# Altium schematic sheet cnc.SchDoc
size A2
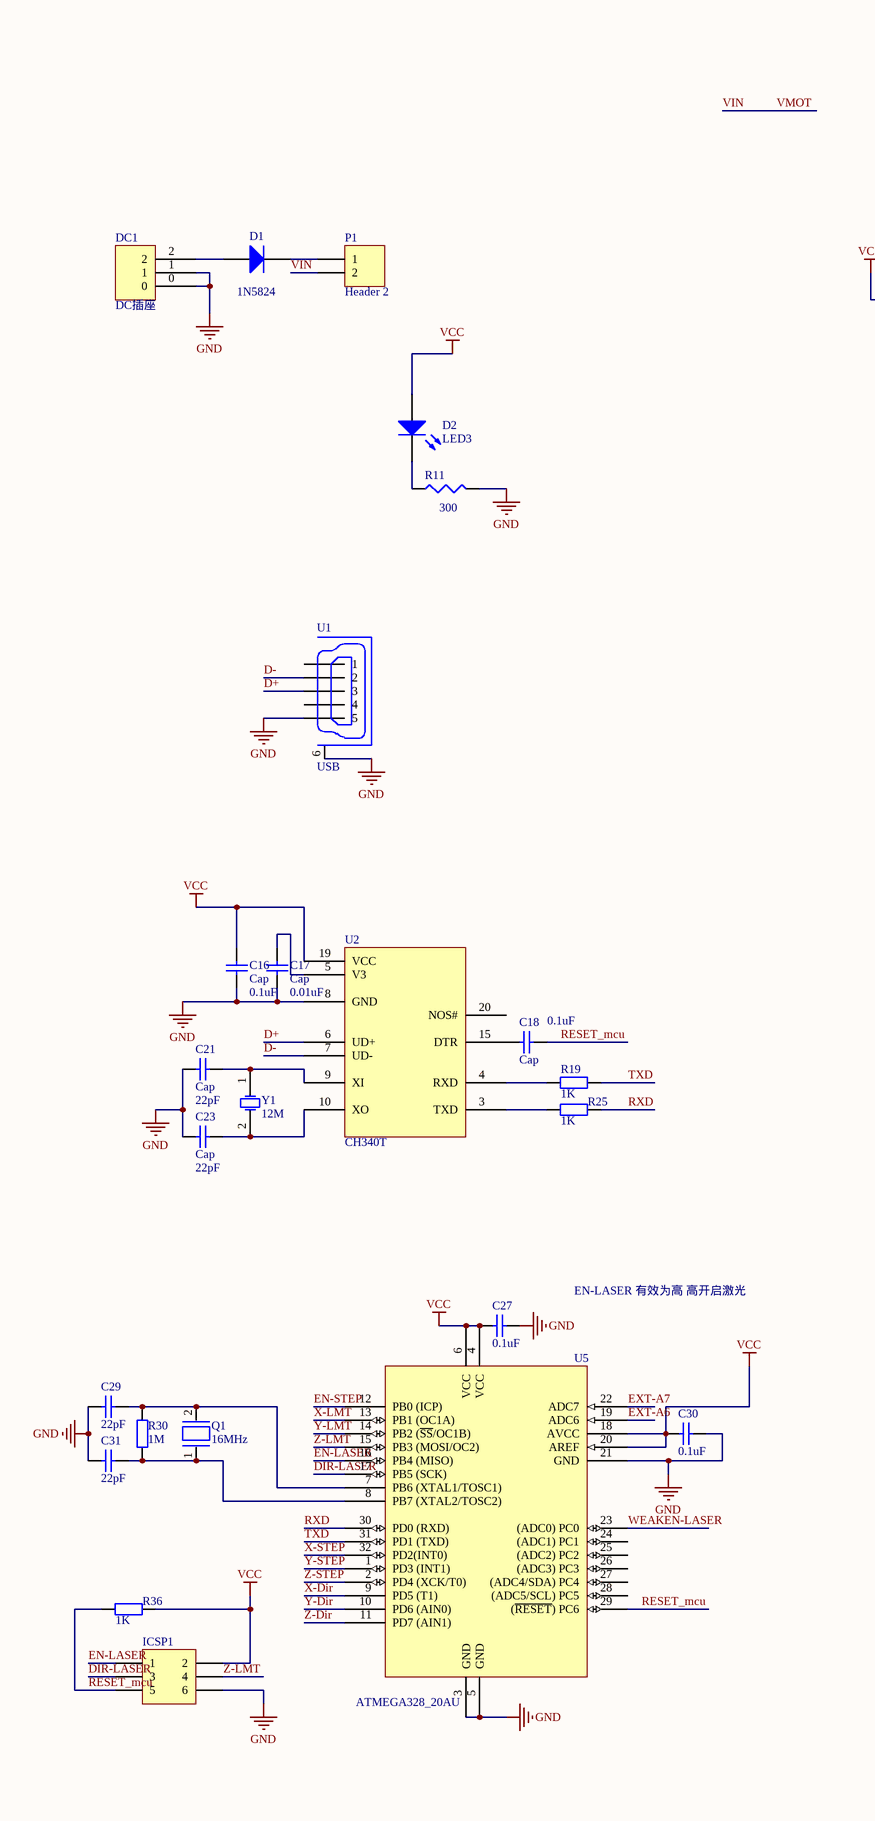
[diagram p0: cnc.SchDoc, left]
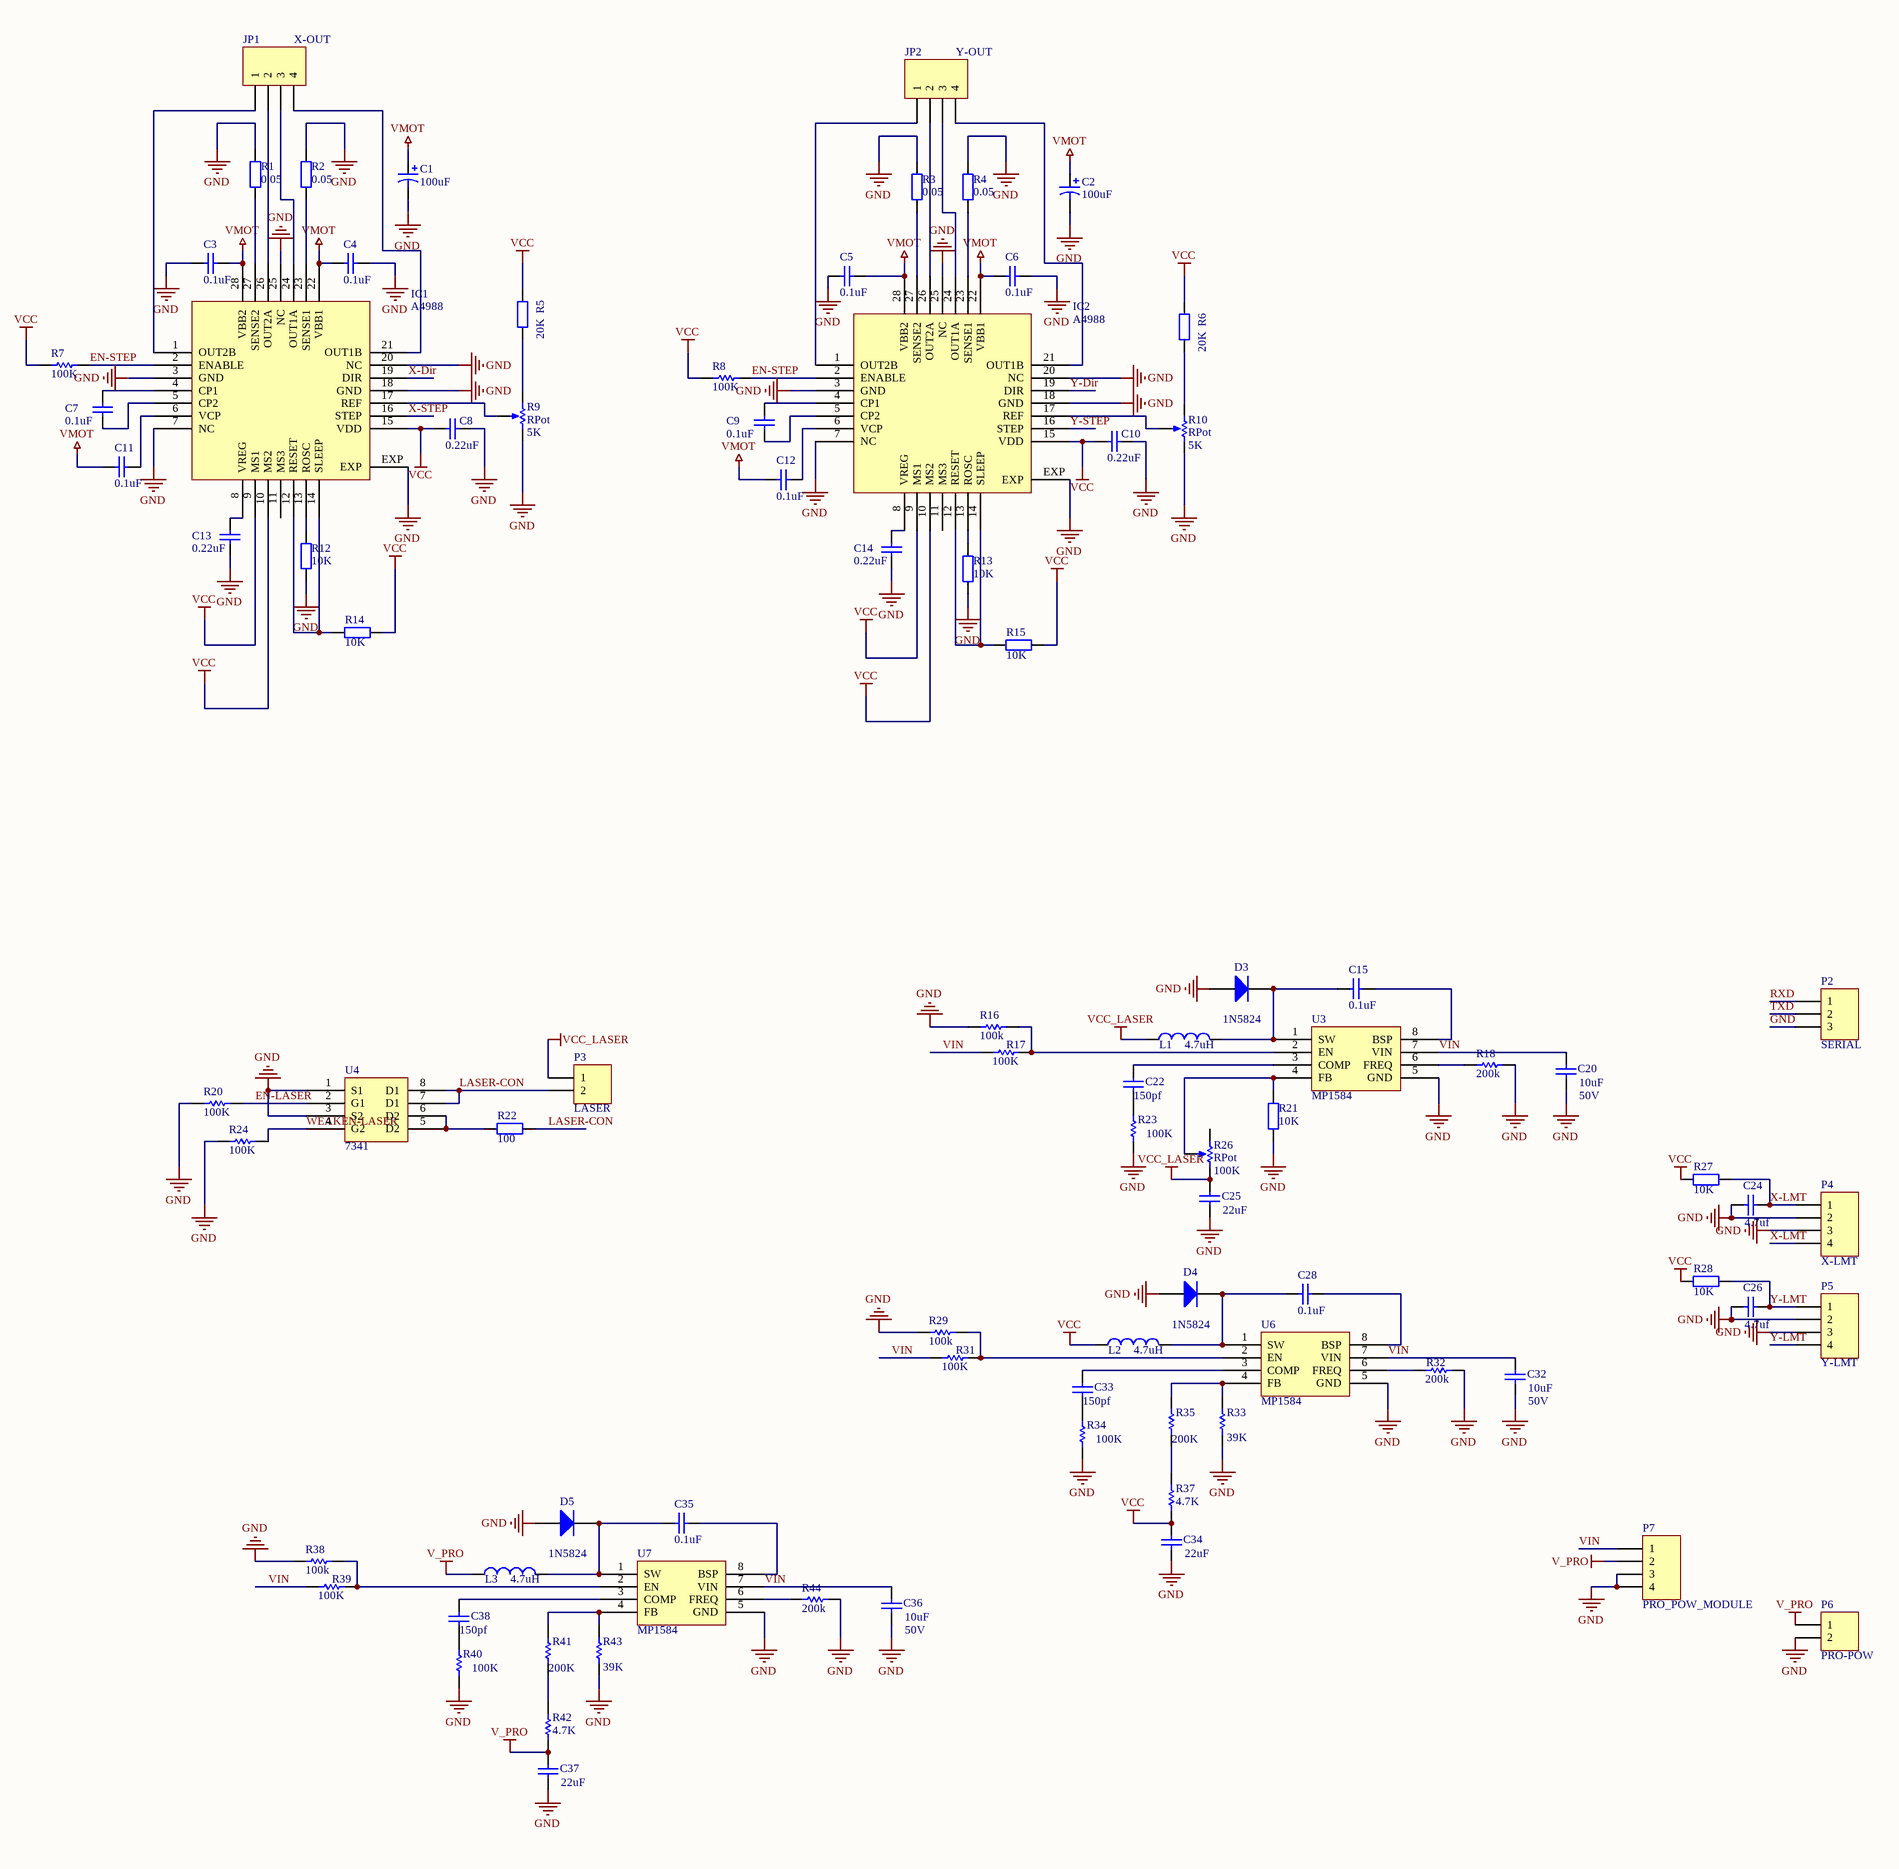
[diagram p1: cnc.SchDoc, right]

## Parts
C1  value 100uF  [CD6032]  (hidden comment: Cap Pol1)
C2  value 100uF  [CD6032]  (hidden comment: Cap Pol1)
C3  value 0.1uF  [C0603]  (hidden comment: Cap)
C4  value 0.1uF  [C0603]  (hidden comment: Cap)
C5  value 0.1uF  [C0603]  (hidden comment: Cap)
C6  value 0.1uF  [C0603]  (hidden comment: Cap)
C7  value 0.1uF  [C0603]  (hidden comment: Cap)
C8  value 0.22uF  [C0603]  (hidden comment: Cap)
C9  value 0.1uF  [C0603]  (hidden comment: Cap)
C10  value 0.22uF  [C0603]  (hidden comment: Cap)
C11  value 0.1uF  [C0603]  (hidden comment: Cap)
C12  value 0.1uF  [C0603]  (hidden comment: Cap)
C13  value 0.22uF  [C0603]  (hidden comment: Cap)
C14  value 0.22uF  [C0603]  (hidden comment: Cap)
C15  value 0.1uF  [C0603]  (hidden comment: Cap)
C16  Cap  value 0.1uF  [C0603]
C17  Cap  value 0.01uF  [C0603]
C18  Cap  value 0.1uF  [C0603]
C20  50V  value 10uF  [C0603]
C21  Cap  value 22pF  [C0603]
C22  value 150pf  [C0603]  (hidden comment: Cap)
C23  Cap  value 22pF  [C0603]
C24  value 4.7uf  [C0603]  (hidden comment: Cap)
C25  value 22uF  [C0603]  (hidden comment: Cap)
C26  value 4.7uf  [C0603]  (hidden comment: Cap)
C27  value 0.1uF  [C0603]  (hidden comment: Cap)
C28  value 0.1uF  [C0603]  (hidden comment: Cap)
C29  value 22pF  [C0603]  (hidden comment: Cap)
C30  value 0.1uF  [C0603]  (hidden comment: Cap)
C31  value 22pF  [C0603]  (hidden comment: Cap)
C32  50V  value 10uF  [C0603]
C33  value 150pf  [C0603]  (hidden comment: Cap)
C34  value 22uF  [C0603]  (hidden comment: Cap)
C35  value 0.1uF  [C0603]  (hidden comment: Cap)
C36  50V  value 10uF  [C0603]
C37  value 22uF  [C0603]  (hidden comment: Cap)
C38  value 150pf  [C0603]  (hidden comment: Cap)
D1  1N5824  [SS34]
D2  LED3  [LED]
D3  1N5824  [SS34]
D4  1N5824  [SS34]
D5  1N5824  [SS34]
DC1  DC插座  [DC座]
IC1  A4988  [QFN28ET]
IC2  A4988  [QFN28ET]
ICSP1  Header 3X2  [HDR2X3]  (value not drawn)
JP1  X-OUT  [XH-2.54-4]
JP2  Y-OUT  [XH-2.54-4]
L1  value 4.7uH  [L_1584]  (hidden comment: Inductor)
L2  value 4.7uH  [L_1584]  (hidden comment: Inductor)
L3  value 4.7uH  [L_1584]  (hidden comment: Inductor)
P1  Header 2  [XH-2.54-2]
P2  SERIAL  [HDR1X3]
P3  LASER  [XH-2.54-2]
P4  X-LMT  [XH-2.54-4]
P5  Y-LMT  [XH-2.54-4]
P6  PRO-POW  [XH-2.54-2]
P7  PRO_POW_MODULE  [mp1584module]
Q1  16MHz  [QS]
R1  value 0.05  [1206]  (hidden comment: Res2)
R2  value 0.05  [1206]  (hidden comment: Res2)
R3  value 0.05  [1206]  (hidden comment: Res2)
R4  value 0.05  [1206]  (hidden comment: Res2)
R5  value 20K  [R0603]  (hidden comment: Res2)
R6  value 20K  [R0603]  (hidden comment: Res2)
R7  value 100K  [R0603]  (hidden comment: Res1)
R8  value 100K  [R0603]  (hidden comment: Res1)
R9  RPot  value 5K  [电位器]
R10  RPot  value 5K  [电位器]
R11  value 300  [R0603]  (hidden comment: Res3)
R12  value 10K  [R0603]  (hidden comment: Res2)
R13  value 10K  [R0603]  (hidden comment: Res2)
R14  value 10K  [R0603]  (hidden comment: Res2)
R15  value 10K  [R0603]  (hidden comment: Res2)
R16  value 100k  [R0603]  (hidden comment: Res1)
R17  value 100K  [R0603]  (hidden comment: Res1)
R18  value 200k  [R0603]  (hidden comment: Res1)
R19  value 1K  [R0603]  (hidden comment: Res2)
R20  value 100K  [R0603]  (hidden comment: Res1)
R21  value 10K  [R0603]  (hidden comment: Res2)
R22  value 100  [R0603]  (hidden comment: Res2)
R23  value 100K  [R0603]  (hidden comment: Res1)
R24  value 100K  [R0603]  (hidden comment: Res1)
R25  value 1K  [R0603]  (hidden comment: Res2)
R26  RPot  value 100K  [电位器]
R27  value 10K  [R0603]  (hidden comment: Res2)
R28  value 10K  [R0603]  (hidden comment: Res2)
R29  value 100k  [R0603]  (hidden comment: Res1)
R30  value 1M  [R0603]  (hidden comment: Res2)
R31  value 100K  [R0603]  (hidden comment: Res1)
R32  value 200k  [R0603]  (hidden comment: Res1)
R33  value 39K  [R0603]  (hidden comment: Res1)
R34  value 100K  [R0603]  (hidden comment: Res1)
R35  value 200K  [R0603]  (hidden comment: Res1)
R36  value 1K  [R0603]  (hidden comment: Res2)
R37  value 4.7K  [R0603]  (hidden comment: Res1)
R38  value 100k  [R0603]  (hidden comment: Res1)
R39  value 100K  [R0603]  (hidden comment: Res1)
R40  value 100K  [R0603]  (hidden comment: Res1)
R41  value 200K  [R0603]  (hidden comment: Res1)
R42  value 4.7K  [R0603]  (hidden comment: Res1)
R43  value 39K  [R0603]  (hidden comment: Res1)
R44  value 200k  [R0603]  (hidden comment: Res1)
U1  USB  [MICRO-USB]
U2  CH340T  [SSOP-20]
U3  MP1584  [SOIC127P720X170-8N]
U4  7341  [SOIC127P720X170-8N]
U5  ATMEGA328_20AU  [TQFP32]
U6  MP1584  [SOIC127P720X170-8N]
U7  MP1584  [SOIC127P720X170-8N]
Y1  12M  [QS]

## Nets
GND: C1.2 C2.2 C3.1 C4.2 C5.1 C6.2 C8.2 C10.2 C13.1 C14.1 C16.1 C17.1 C20.2 C21.1 C23.1 C24.2 C25.2 C26.2 C27.1 C29.2 C30.1 C31.2 C32.2 C34.2 C36.2 C37.2 D3.1(A) D4.1(A) D5.1(A) DC1.0 DC1.1 IC1.3(GND) IC1.7(NC) IC1.18(GND) IC1.20(NC) IC1.25(NC) IC1.EXP IC2.3(GND) IC2.7(NC) IC2.18(GND) IC2.20(NC) IC2.25(NC) IC2.EXP ICSP1.6 P2.3 P4.2 P4.3 P5.2 P5.3 P6.2 P7.3 P7.4 R1.2 R2.2 R3.2 R4.2 R9.2(BOT) R10.2(BOT) R11.2 R12.1 R13.1 R16.1 R18.1 R20.2 R21.1 R23.1 R24.2 R29.1 R32.1 R33.1 R34.1 R38.1 R40.1 R43.1 R44.1 U1.5 U1.6 U2.8(GND) U3.5(GND) U4.1(S1) U4.3(S2) U5.3(GND) U5.5(GND) U5.21(GND) U6.5(GND) U7.5(GND)
V_PRO: C37.1 L3.1 P6.1 P7.2 R42.1
VCC: C8.1 C10.1 C16.2 C27.2 C30.2 C34.1 D2.1(A) IC1.9(MS1) IC1.10(MS2) IC1.15(VDD) IC2.9(MS1) IC2.10(MS2) IC2.15(VDD) ICSP1.2 L2.1 R5.2 R6.2 R7.2 R8.2 R14.2 R15.2 R27.2 R28.2 R36.2 R37.1 U2.19(VCC) U5.4(VCC) U5.6(VCC) U5.18(AVCC) U5.20(AREF)
VCC_LASER: C25.1 L1.1 P3.1 R26.2(BOT)
VIN: C1.1 C2.1 C3.2 C4.1 C5.2 C6.1 C11.1 C12.1 C20.1 C32.1 C36.1 IC1.22(VBB1) IC1.28(VBB2) IC2.22(VBB1) IC2.28(VBB2) P1.2 P7.1 R17.1 R31.1 R39.1 U3.7(VIN) U6.7(VIN) U7.7(VIN)  [also labelled VMOT]
D+: U1.3 U2.6(UD+)
D-: U1.2 U2.7(UD-)
DIR-LASER: ICSP1.3 U5.17(PB5_(SCK))
EN-LASER: ICSP1.1 R20.1 U4.2(G1) U5.16(PB4_(MISO))
EN-STEP: IC1.2(ENABLE) IC2.2(ENABLE) R7.1 R8.1 U5.12(PB0_(ICP))
EXT-A6: U5.19(ADC6)
EXT-A7: U5.22(ADC7)
LASER-CON: P3.2 R22.1 U4.7(D1) U4.8(D1)
RESET_mcu: C18.2 ICSP1.5 R36.1 U5.29((~{RESET})_PC6)
RXD: P2.1 R25.2 U5.30(PD0_(RXD))
TXD: P2.2 R19.1 U5.31(PD1_(TXD))
WEAKEN-LASER: R24.1 U4.4(G2) U5.23((ADC0)_PC0)
X-Dir: IC1.19(DIR) U5.9(PD5_(T1))
X-LMT: C24.1 P4.1 P4.4 R27.1 U5.13(PB1_(OC1A))
X-STEP: IC1.16(STEP) U5.32(PD2(INT0))
Y-Dir: IC2.19(DIR) U5.10(PD6_(AIN0))
Y-LMT: C26.1 P5.1 P5.4 R28.1 U5.14(PB2_(~{SS}/OC1B))
Y-STEP: IC2.16(STEP) U5.1(PD3_(INT1))
Z-Dir: U5.11(PD7_(AIN1))
Z-LMT: ICSP1.4 U5.15(PB3_(MOSI/OC2))
Z-STEP: U5.2(PD4_(XCK/T0))
NetC7_1: C7.1 IC1.5(CP2)
NetC7_2: C7.2 IC1.4(CP1)
NetC9_1: C9.1 IC2.5(CP2)
NetC9_2: C9.2 IC2.4(CP1)
NetC11_2: C11.2 IC1.6(VCP)
NetC12_2: C12.2 IC2.6(VCP)
NetC13_2: C13.2 IC1.8(VREG)
NetC14_2: C14.2 IC2.8(VREG)
NetC15_1: C15.1 D3.2(K) L1.2 U3.1(SW)
NetC15_2: C15.2 U3.8(BSP)
NetC17_2: C17.2 U2.5(V3)
NetC18_1: C18.1 U2.15(DTR)
NetC21_2: C21.2 U2.9(XI) Y1.1(OSC1)
NetC22_1: C22.1 U3.3(COMP)
NetC22_2: C22.2 R23.2
NetC23_2: C23.2 U2.10(XO) Y1.2(OSC2)
NetC28_1: C28.1 D4.2(K) L2.2 U6.1(SW)
NetC28_2: C28.2 U6.8(BSP)
NetC29_1: C29.1 Q1.2 R30.1 U5.7(PB6_(XTAL1/TOSC1))
NetC31_1: C31.1 Q1.1 R30.2 U5.8(PB7_(XTAL2/TOSC2))
NetC33_1: C33.1 U6.3(COMP)
NetC33_2: C33.2 R34.2
NetC35_1: C35.1 D5.2(K) L3.2 U7.1(SW)
NetC35_2: C35.2 U7.8(BSP)
NetC38_1: C38.1 U7.3(COMP)
NetC38_2: C38.2 R40.2
NetD1_1: D1.1(A) DC1.2
NetD1_2: D1.2(K) P1.1
NetD2_2: D2.2(K) R11.1
NetIC1_1: IC1.1(OUT2B) JP1.1
NetIC1_12: IC1.12(RESET) IC1.14(SLEEP) R14.1
NetIC1_13: IC1.13(ROSC) R12.2
NetIC1_17: IC1.17(REF) R9.3(TAP)
NetIC1_21: IC1.21(OUT1B) JP1.4
NetIC1_23: IC1.23(SENSE1) R2.1
NetIC1_24: IC1.24(OUT1A) JP1.3
NetIC1_26: IC1.26(OUT2A) JP1.2
NetIC1_27: IC1.27(SENSE2) R1.1
NetIC2_1: IC2.1(OUT2B) JP2.1
NetIC2_12: IC2.12(RESET) IC2.14(SLEEP) R15.1
NetIC2_13: IC2.13(ROSC) R13.2
NetIC2_17: IC2.17(REF) R10.3(TAP)
NetIC2_21: IC2.21(OUT1B) JP2.4
NetIC2_23: IC2.23(SENSE1) R4.1
NetIC2_24: IC2.24(OUT1A) JP2.3
NetIC2_26: IC2.26(OUT2A) JP2.2
NetIC2_27: IC2.27(SENSE2) R3.1
NetR5_1: R5.1 R9.1(TOP)
NetR6_1: R6.1 R10.1(TOP)
NetR16_2: R16.2 R17.2 U3.2(EN)
NetR18_2: R18.2 U3.6(FREQ)
NetR19_2: R19.2 U2.4(RXD)
NetR21_2: R21.2 R26.3(TAP) U3.4(FB)
NetR22_2: R22.2 U4.5(D2) U4.6(D2)
NetR25_1: R25.1 U2.3(TXD)
NetR29_2: R29.2 R31.2 U6.2(EN)
NetR32_2: R32.2 U6.6(FREQ)
NetR33_2: R33.2 R35.2 U6.4(FB)
NetR35_1: R35.1 R37.2
NetR38_2: R38.2 R39.2 U7.2(EN)
NetR41_1: R41.1 R42.2
NetR41_2: R41.2 R43.2 U7.4(FB)
NetR44_2: R44.2 U7.6(FREQ)

Not connected (* = marked no-connect by the designer): IC1 11(MS3); IC2 11(MS3); R26 1(TOP); U1 1 4; U2 20(NOS#); U5 24((ADC1)_PC1) 25((ADC2)_PC2) 26((ADC3)_PC3) 27((ADC4/SDA)_PC4) 28((ADC5/SCL)_PC5)

## Notes on the sheet
- EN-LASER 有效为高 高开启激光

## Library data of the parts
C1 C2 = Cap Pol1: Polarized Capacitor (Radial); Published: 8-Jun-2000; LatestRevisionDate: 17-Jul-2002; LatestRevisionNote: Re-released for DXP Platform.; PackageReference: RB7.6-15; Publisher: Altium Limited
C3-C18 C20-C38 = Cap: Capacitor; Published: 8-Jun-2000; LatestRevisionDate: 17-Jul-2002; LatestRevisionNote: Re-released for DXP Platform.; PackageReference: RAD-0.3; Publisher: Altium Limited
D1 D3-D5 = Diode 1N4007: 1 Amp General Purpose Rectifier; Published: 8-Jun-2000; LatestRevisionDate: 17-Jul-2002; LatestRevisionNote: Re-released for DXP Platform.; PackageReference: DO-41; Publisher: Altium Limited; Code_JEDEC: DO-204-AL; ComponentLink1Description: Manufacturer Link; ComponentLink1URL: http://www.fairchildsemi.com/; ComponentLink2Description: Datasheet; ComponentLink2URL: http://www.fairchildsemi.com/ds/1N%2F1N4001.pdf; DatasheetDocument: 1998; PackageDocument: Aug-1999
D2 = LED3: Typical BLUE SiC LED; Published: 8-Jun-2000; LatestRevisionDate: 17-Dec-2003; LatestRevisionNote: PCB Footprint replaced.; DatasheetVersion: 16-Apr-2002; PackageVersion: 16-Apr-2002; PackageReference: 3.5X2.8X1.9; Publisher: Altium Limited
ICSP1 = Header 3X2: Header, 3-Pin, Dual row; LatestRevisionDate: 17-Jul-2002; LatestRevisionNote: Re-released for DXP Platform.; Publisher: Altium Limited
JP1 JP2 P4 P5 P7 = Header 4: Header, 4-Pin; LatestRevisionDate: 17-Jul-2002; LatestRevisionNote: Re-released for DXP Platform.; Publisher: Altium Limited
L1-L3 = Inductor: Code_IEC: 1005; Published: 8-Jun-2000; LatestRevisionDate: 29-May-2009; LatestRevisionNote: IPC-7351 Footprint Added.; PackageReference: 0402-A; Publisher: Altium Limited; PackageDescription: Chip Inductor; Code_JEITA: 0402
P1 P3 P6 = Header 2: Header, 2-Pin; LatestRevisionDate: 17-Jul-2002; LatestRevisionNote: Re-released for DXP Platform.; Publisher: Altium Limited
P2 = Header 3: Header, 3-Pin; LatestRevisionDate: 17-Jul-2002; LatestRevisionNote: Re-released for DXP Platform.; Publisher: Altium Limited
Q1 = XTAL/S
R1-R6 R12-R15 R19 R21 R22 R25 R27 R28 R30 R36 = Res2: Resistor; Published: 8-Jun-2000; LatestRevisionDate: 17-Jul-2002; LatestRevisionNote: Re-released for DXP Platform.; PackageReference: AXIAL-0.4; Publisher: Altium Limited
R7 R8 R16-R18 R20 R23 R24 R29 R31-R35 R37-R44 = Res1: Resistor; Published: 8-Jun-2000; LatestRevisionDate: 17-Jul-2002; LatestRevisionNote: Re-released for DXP Platform.; PackageReference: AXIAL-0.3; Publisher: Altium Limited
R9 R10 R26 = RPot: Potentiometer; Sim Note: Enter the Resistance value and the set point into parameter fields.; Set Position: 0.5; Published: 8-Jun-2000; LatestRevisionDate: 17-Jul-2002; LatestRevisionNote: Re-released for DXP Platform.; PackageReference: VR5; Publisher: Altium Limited
R11 = Res3: Resistor; Published: 8-Jun-2000; LatestRevisionDate: 29-May-2009; LatestRevisionNote: IPC-7351 Footprint Added.; PackageReference: J1-0603; Publisher: Altium Limited; PackageDescription: Chip Resistor
U1 = MOLEX_MICRO_USB_AB_BOTTOM_MOUNT
U4 = Component_1
U5 = ATMEGA8_TQFP32: Atmel Microcontroller - Library created by carel..  <www.mpfreezone.com>
Y1 = XTAL: Crystal Oscillator; Published: 8-Jun-2000; LatestRevisionDate: 17-Jul-2002; LatestRevisionNote: Re-released for DXP Platform.; PackageReference: R38; Publisher: Altium Limited